# EAGLE design CPM_Uext (EAGLE 6.4)
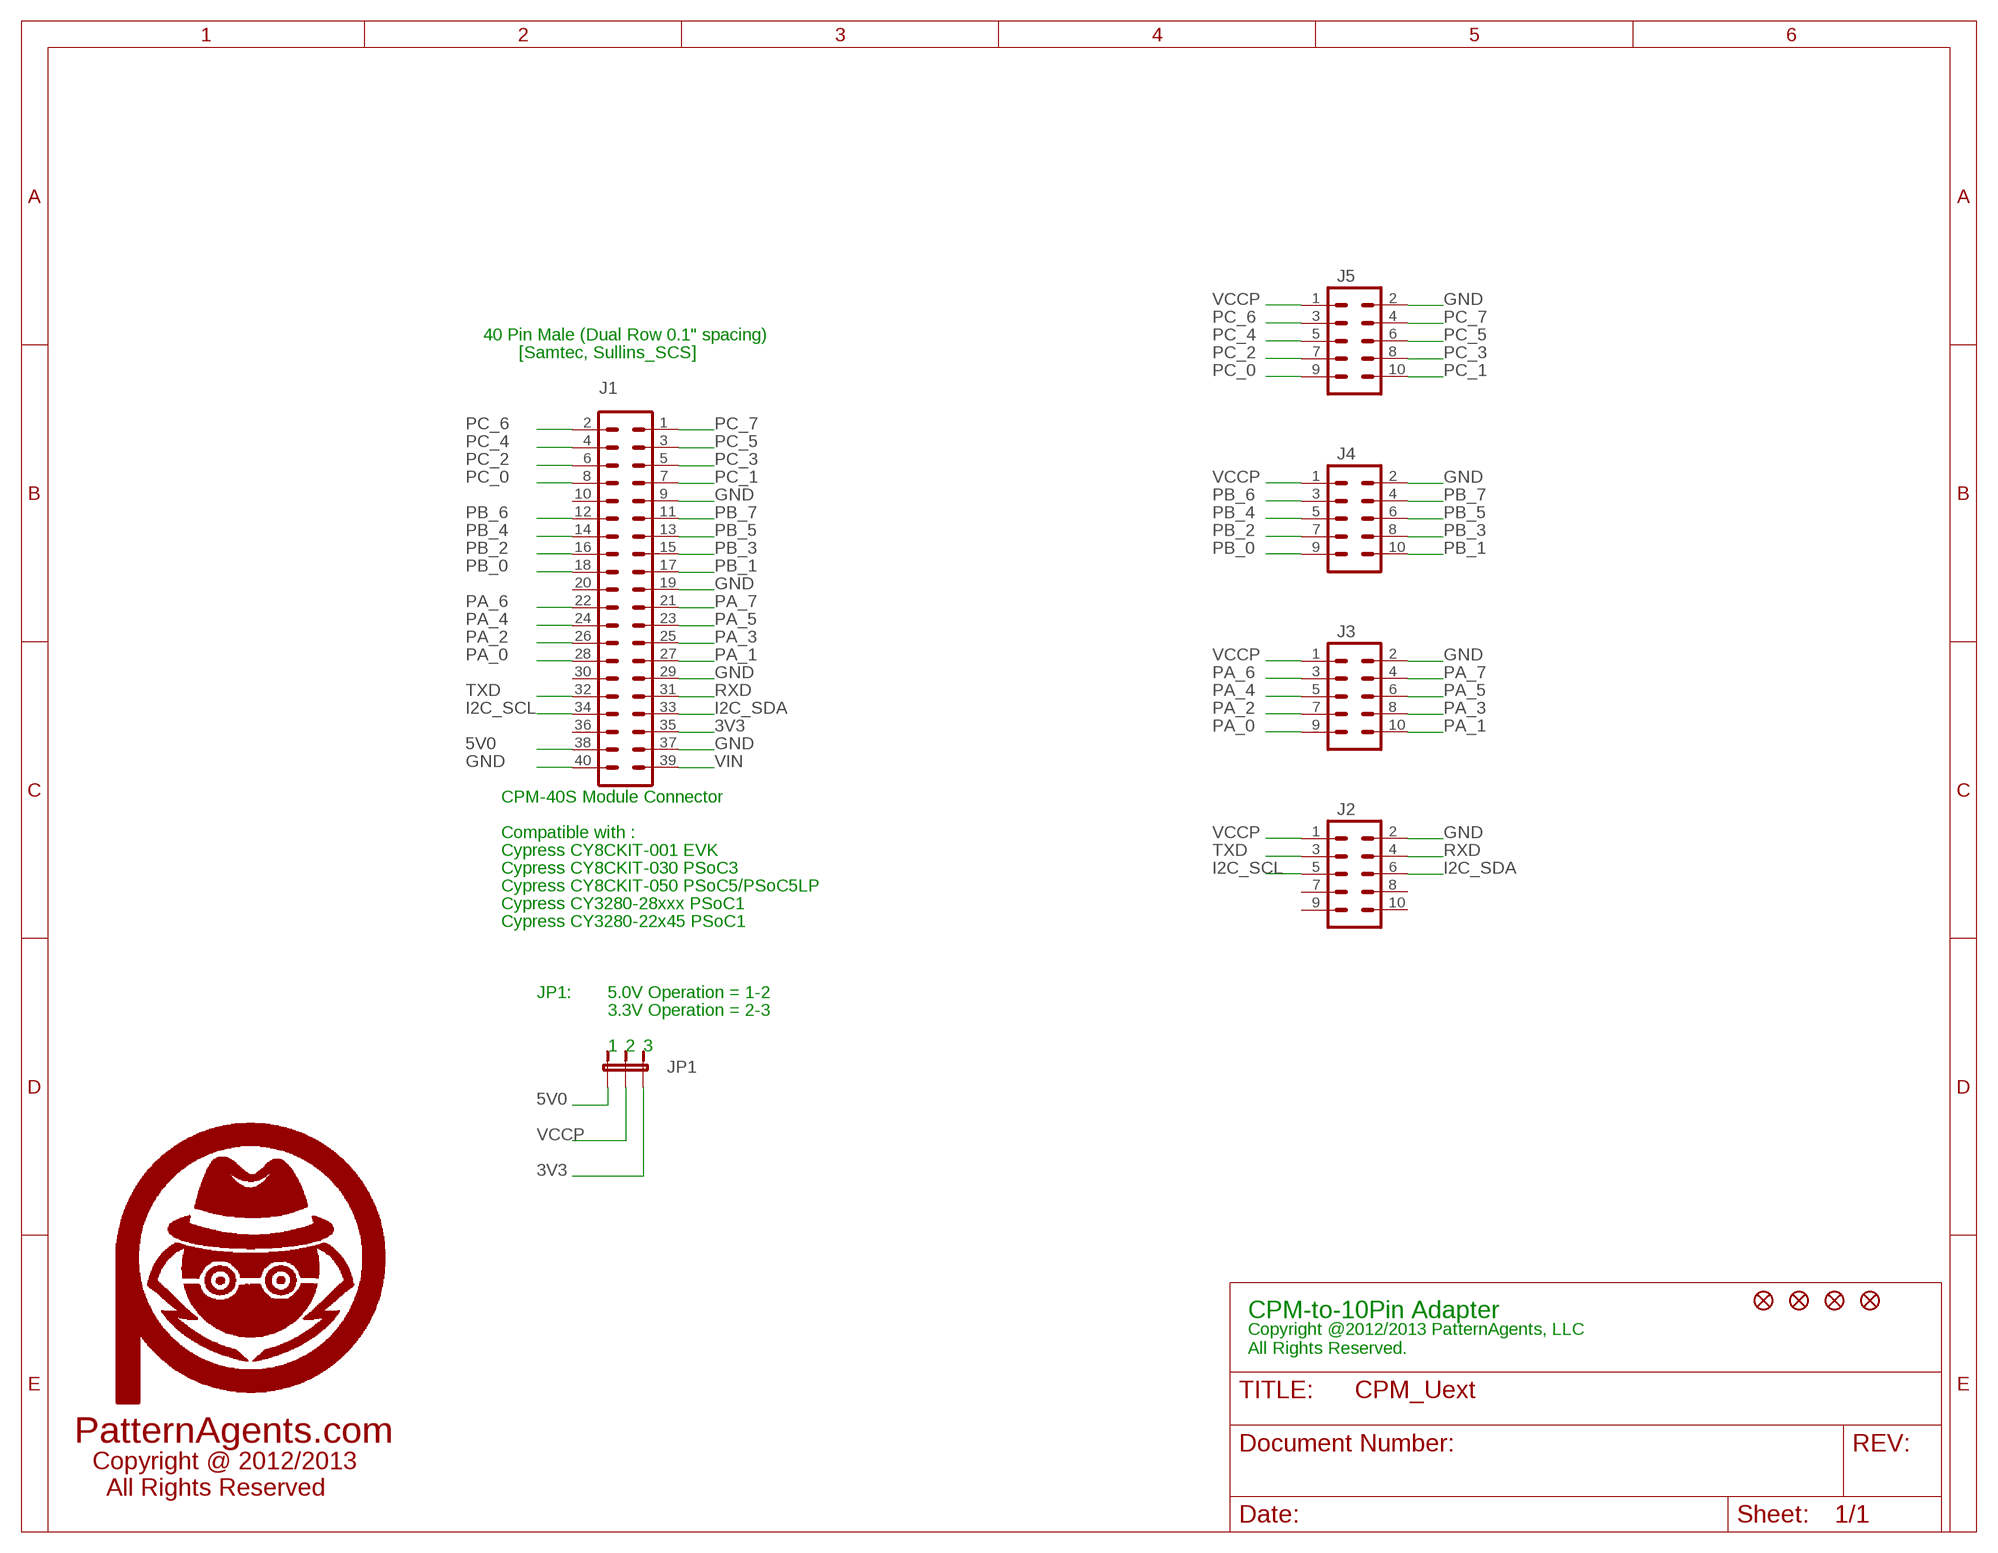
[diagram p0: schematic, sheet 1]

## Parts
J1  SULLINS_SCS  MA20-2  [MA20-2]
J2  M05X2  [2X5-UEXT]
J3  M05X2  [2X5-UEXT]
J4  M05X2  [2X5-UEXT]
J5  M05X2  [2X5-UEXT]
JP1  JUMPER-3PTH  [1X03]
JP2  FIDUCIAL1.5X3  [FIDUCIAL-1.5X3]
JP3  FIDUCIAL1.5X3  [FIDUCIAL-1.5X3]
JP4  FIDUCIAL1.5X3  [FIDUCIAL-1.5X3]
JP5  FIDUCIAL1.5X3  [FIDUCIAL-1.5X3]
U$1  LOGO_PA_AGENTLARGE  [LOGO_PA_AGENT_LARGE]

## Nets
3V3: J1.35 JP1.3
5V0: J1.38 JP1.1
GND: J1.9 J1.19 J1.29 J1.37 J1.40 J2.2 J3.2 J4.2 J5.2
I2C_SCL: J1.34 J2.5
I2C_SDA: J1.33 J2.6
PA_0: J1.28 J3.9
PA_1: J1.27 J3.10
PA_2: J1.26 J3.7
PA_3: J1.25 J3.8
PA_4: J1.24 J3.5
PA_5: J1.23 J3.6
PA_6: J1.22 J3.3
PA_7: J1.21 J3.4
PB_0: J1.18 J4.9
PB_1: J1.17 J4.10
PB_2: J1.16 J4.7
PB_3: J1.15 J4.8
PB_4: J1.14 J4.5
PB_5: J1.13 J4.6
PB_6: J1.12 J4.3
PB_7: J1.11 J4.4
PC_0: J1.8 J5.9
PC_1: J1.7 J5.10
PC_2: J1.6 J5.7
PC_3: J1.5 J5.8
PC_4: J1.4 J5.5
PC_5: J1.3 J5.6
PC_6: J1.2 J5.3
PC_7: J1.1 J5.4
RXD: J1.31 J2.4
TXD: J1.32 J2.3
VCCP: J2.1 J3.1 J4.1 J5.1 JP1.2
VIN: J1.39
Unconnected: J1.10 J1.20 J1.30 J1.36 J2.7 J2.8 J2.9 J2.10

## Notes on the sheet
- 40 Pin Male (Dual Row 0.1" spacing)
- [Samtec, Sullins_SCS]
- CPM-40S Module Connector
- Compatible with :
- Cypress CY8CKIT-001 EVK
- Cypress CY8CKIT-030 PSoC3
- Cypress CY8CKIT-050 PSoC5/PSoC5LP
- Cypress CY3280-28xxx PSoC1
- Cypress CY3280-22x45 PSoC1
- JP1: | 5.0V Operation = 1-2
- 3.3V Operation = 2-3
- 1 | 2 | 3
- CPM-to-10Pin Adapter
- Copyright @2012/2013 PatternAgents, LLC
  All Rights Reserved.
- PatternAgents.com
- Copyright @ 2012/2013
    All Rights Reserved

## Library data of the parts
J1 = moxdes_V1_0:MA20-2: 40 PIN HEADER; MF: Sullins; MPN: PBC20DBAN; OC_FARNELL: unknown; OC_NEWARK: unknown
J2-J5 = moxdes_V1_0:M05X2: Header 5x2 Standard 10-pin dual row 0.1" header. Commonly used with AVR-ISP. Use with Spark Fun Electronics SKU: PRT-00778
JP1 = SparkFun:JUMPER-3
JP2-JP5 = PatternAgents-Misc:FIDUCIAL: Fiducial Alignment Points Various fiducial points for machine vision alignment.
U$1 = PatternAgents-Aesthetics:LOGO_PA_AGENT: PatternAgents Logo Copyright @2012/2013 PatternAgents.com

## Board
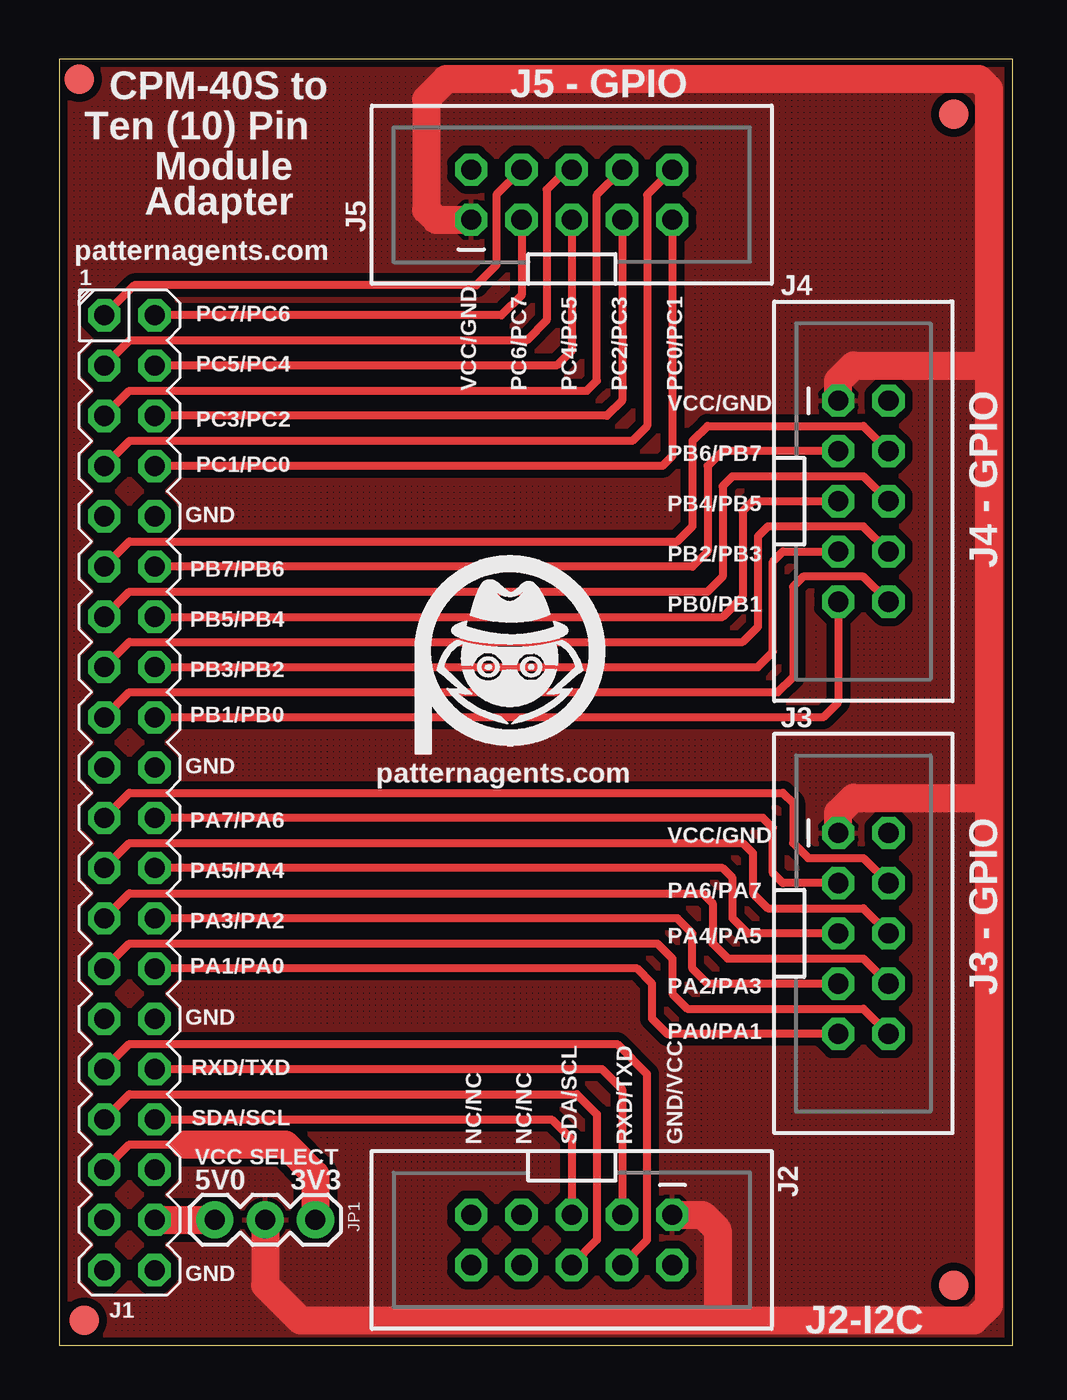
[diagram p1: board, top side]
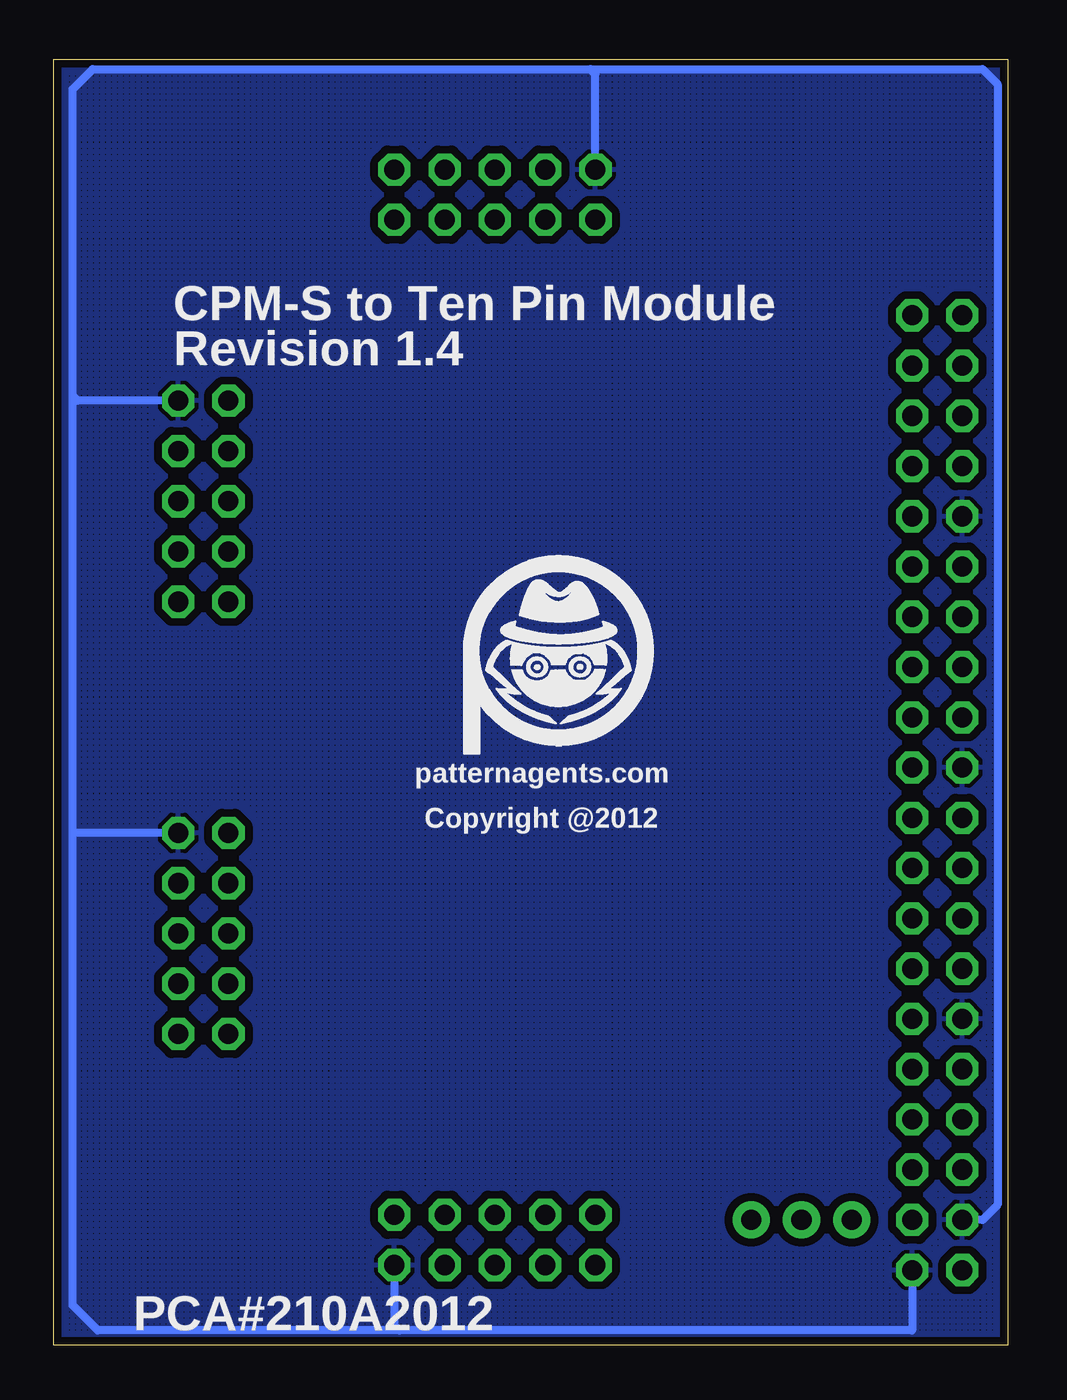
[diagram p2: board, bottom side, seen from below]

Size 48.18 x 65.01 mm. Coordinates in mm from the lower left corner, seen from the top.
Outline: 0,0 48.18,0 48.18,65.01 0,65.01 0,0
Copper layers (1*16): Top 0.035mm / dielectric 1.5mm / Bottom 0.035mm
Design rules "PatternAgents": minimum track width 8mil, minimum drill 14mil, track to track 8mil, track to pad 8mil, pad to pad 8mil, via to via 8mil, smd to smd 8mil, copper to edge 10mil, drill to drill 8mil, minimum pad ring 12mil, minimum via ring 10mil, stop-mask expansion 4mil, vias tented up to drill 25mil, thermal gap 8mil

### Footprints (pad centres in the part's own frame; a part is rotated, then mirrored left to right if it is on the bottom)
MA20-2 = drill 1.016 octagon: 1 -24.13,-1.27; 2 -24.13,1.27; 3 -21.59,-1.27; 4 -21.59,1.27; 5 -19.05,-1.27; 6 -19.05,1.27; 7 -16.51,-1.27; 8 -16.51,1.27; 9 -13.97,-1.27; 10 -13.97,1.27; 11 -11.43,-1.27; 12 -11.43,1.27; 13 -8.89,-1.27; 14 -8.89,1.27; 15 -6.35,-1.27; 16 -6.35,1.27; 17 -3.81,-1.27; 18 -3.81,1.27; 19 -1.27,-1.27; 20 -1.27,1.27; 21 1.27,-1.27; 22 1.27,1.27; 23 3.81,-1.27; 24 3.81,1.27; 25 6.35,-1.27; 26 6.35,1.27; 27 8.89,-1.27; 28 8.89,1.27; 29 11.43,-1.27; 30 11.43,1.27; 31 13.97,-1.27; 32 13.97,1.27; 33 16.51,-1.27; 34 16.51,1.27; 35 19.05,-1.27; 36 19.05,1.27; 37 21.59,-1.27; 38 21.59,1.27; 39 24.13,-1.27; 40 24.13,1.27
2X5-UEXT = drill 1.016 octagon: 1 -1.27,5.08; 2 1.27,5.08; 3 -1.27,2.54; 4 1.27,2.54; 5 -1.27,0; 6 1.27,0; 7 -1.27,-2.54; 8 1.27,-2.54; 9 -1.27,-5.08; 10 1.27,-5.08
1X03 = drill 1.016 pad 1.88: 1 0,0; 2 2.54,0; 3 5.08,0
FIDUCIAL-1.5X3 = smd 1.5 x 1.5: 1 0,0

### Placement (x,y rotation side)
J1  3.56,27.94 270 top
J2  25.91,5.33 270 top
J3  40.64,20.83 0 top
J4  40.64,42.67 0 top
J5  25.91,58.17 90 top
JP1  7.87,6.35 0 top
JP2  45.21,3.05 0 top
JP3  1.27,1.27 0 top
JP4  45.21,62.23 0 top
JP5  1.02,64.01 0 top
U$1  22.61,34.29 0 bottom
U$3  LOGO_PA_AGENTLARGE  [LOGO_PA_AGENT_LARGE]  22.86,34.29 0 top

### Tracks (layer width: path | path; a pad name or v marks a point on that pad's centre or on a via)
3V3
  Top 0.406: J1.35 3.56,10.16 6.35,10.16
  Top 1.422: 6.35,10.16 11.43,10.16 12.95,8.64 JP1.3
5V0
  Top 1.422: J1.38 JP1.1
GND
  Bottom 0.406: J1.40 4.83,0.76 30.73,0.76 | 30.73,0.76 45.97,0.76 47.24,2.03 47.24,25.91 | 47.24,25.91 47.24,48.01 | 47.24,48.01 47.24,63.5 46.23,64.52 21.08,64.52 | 21.08,64.52 1.27,64.52 0.51,63.75 0.51,7.11 1.27,6.35 J1.37 | J5.2 20.83,64.26 21.08,64.52 | J4.2 46.99,47.75 47.24,48.01 | J3.2 47.24,25.91 | J2.2 30.99,1.02 30.73,0.76
  pour Bottom (isolate 0.406, hatched): 0,65.02 48.26,65.02 48.26,0 0,0
I2C_SCL
  Top 0.406: J1.34 24.89,11.43 25.91,10.41 J2.5
I2C_SDA
  Top 0.406: J1.33 3.56,12.7 26.16,12.7 27.18,11.68 27.18,5.33 J2.6
PA_0
  Top 0.406: J3.9 30.73,15.75 29.97,16.51 29.97,18.29 29.21,19.05 J1.28
PA_1
  Top 0.406: J1.27 3.56,20.32 30.23,20.32 30.99,19.56 30.99,17.78 31.75,17.02 40.64,17.02 J3.10
PA_2
  Top 0.406: J3.7 32.77,18.29 32,19.05 32,20.83 31.24,21.59 J1.26
PA_3
  Top 0.406: J1.25 3.56,22.86 32.51,22.86 33.02,22.35 33.02,20.32 33.78,19.56 40.64,19.56 J3.8
PA_4
  Top 0.406: J3.5 34.8,20.83 34.04,21.59 34.04,23.62 33.53,24.13 J1.24
PA_5
  Top 0.406: J1.23 3.56,25.4 34.54,25.4 35.05,24.89 35.05,22.86 35.81,22.1 40.64,22.1 J3.6
PA_6
  Top 0.406: J3.3 36.58,23.37 36.07,23.88 36.07,26.16 35.56,26.67 J1.22
PA_7
  Top 0.406: J1.21 3.56,27.94 36.58,27.94 37.08,27.43 37.08,25.4 37.85,24.64 40.64,24.64 J3.4
PB_0
  Top 0.406: J4.9 39.37,32.51 38.61,31.75 J1.18
PB_1
  Top 0.406: J4.10 40.64,38.86 37.59,38.86 37.08,38.35 37.08,33.78 36.32,33.02 3.56,33.02 J1.17
PB_2
  Top 0.406: J1.16 35.31,34.29 36.07,35.05 36.07,39.62 36.58,40.13 J4.7
PB_3
  Top 0.406: J4.8 40.64,41.4 35.81,41.4 35.31,40.89 35.31,36.32 34.54,35.56 3.56,35.56 J1.15
PB_4
  Top 0.406: J1.14 33.53,36.83 34.54,37.85 34.54,42.16 35.05,42.67 J4.5
PB_5
  Top 0.406: J1.13 3.56,38.1 32.77,38.1 33.53,38.86 33.53,43.43 34.04,43.94 40.64,43.94 J4.6
PB_6
  Top 0.406: J4.3 33.53,45.21 32.77,44.45 32.77,40.13 32,39.37 J1.12
PB_7
  Top 0.406: J1.11 3.56,40.64 31.24,40.64 32,41.4 32,45.72 32.77,46.48 40.64,46.48 J4.4
PC_0
  Top 0.406: J5.9 30.99,44.96 30.48,44.45 J1.8
PC_1
  Top 0.406: J5.10 29.72,58.17 29.72,46.48 28.96,45.72 3.56,45.72 J1.7
PC_2
  Top 0.406: J5.7 28.45,47.75 27.69,46.99 J1.6
PC_3
  Top 0.406: J1.5 3.56,48.26 26.67,48.26 27.18,48.77 27.18,58.17 J5.8
PC_4
  Top 0.406: J5.5 25.91,50.29 25.15,49.53 J1.4
PC_5
  Top 0.406: J5.6 25.65,59.44 24.64,58.42 24.64,51.82 23.62,50.8 3.56,50.8 J1.3
PC_6
  Top 0.406: J5.3 23.37,53.09 22.35,52.07 J1.2
PC_7
  Top 0.406: J5.4 22.1,58.17 22.1,54.61 21.08,53.59 3.81,53.59 J1.1
RXD
  Top 0.406: J2.4 29.72,5.33 29.72,13.72 28.19,15.24 3.56,15.24 J1.31
TXD
  Top 0.406: J1.32 27.43,13.97 28.45,12.95 J2.3
VCCP
  Top 1.422: JP1.2 10.41,3.05 12.19,1.27 33.53,1.27 | 33.53,1.27 46.23,1.27 46.99,2.03 46.99,27.69 | 46.99,27.69 46.99,49.53 | 46.99,49.53 46.99,63.5 46.48,64.01 19.56,64.01 18.54,62.99 18.54,57.4 19.05,56.9 J5.1 | J4.1 39.37,48.77 40.13,49.53 46.99,49.53 | J3.1 39.37,26.92 40.13,27.69 46.99,27.69 | J2.1 32.51,6.6 33.27,5.84 33.27,1.52 33.53,1.27
  pour Top (isolate 0.406, hatched): 0,65.02 48.26,65.02 48.26,0 0,0

### Text on the board
tPlace: J5 - GPIO | CPM-40S to | Ten (10) Pin | Module | Adapter | patternagents.com | 1 | PC7/PC6 | PC5/PC4 | VCC/GND | PC6/PC7 | PC4/PC5 | PC2/PC3 | PC0/PC1 | J4 - GPIO | PC3/PC2 | VCC/GND | PC1/PC0 | PB6/PB7 | GND | PB4/PB5 | PB2/PB3 | PB7/PB6 | PB0/PB1 | PB5/PB4 | PB3/PB2 | PB1/PB0 | GND | patternagents.com | J3 - GPIO | PA7/PA6 | VCC/GND | PA5/PA4 | PA6/PA7 | PA3/PA2 | PA4/PA5 | PA1/PA0 | PA2/PA3 | GND | PA0/PA1 | RXD/TXD | SDA/SCL | NC/NC | NC/NC | SDA/SCL | RXD/TXD | GND/VCC | VCC SELECT | 5V0 | 3V3 | GND | J2-I2C
bPlace: CPM-S to Ten Pin Module | Revision 1.4 | patternagents.com | Copyright @2012 | PCA#210A2012